# EAGLE design Output_Shield (EAGLE 5.06)
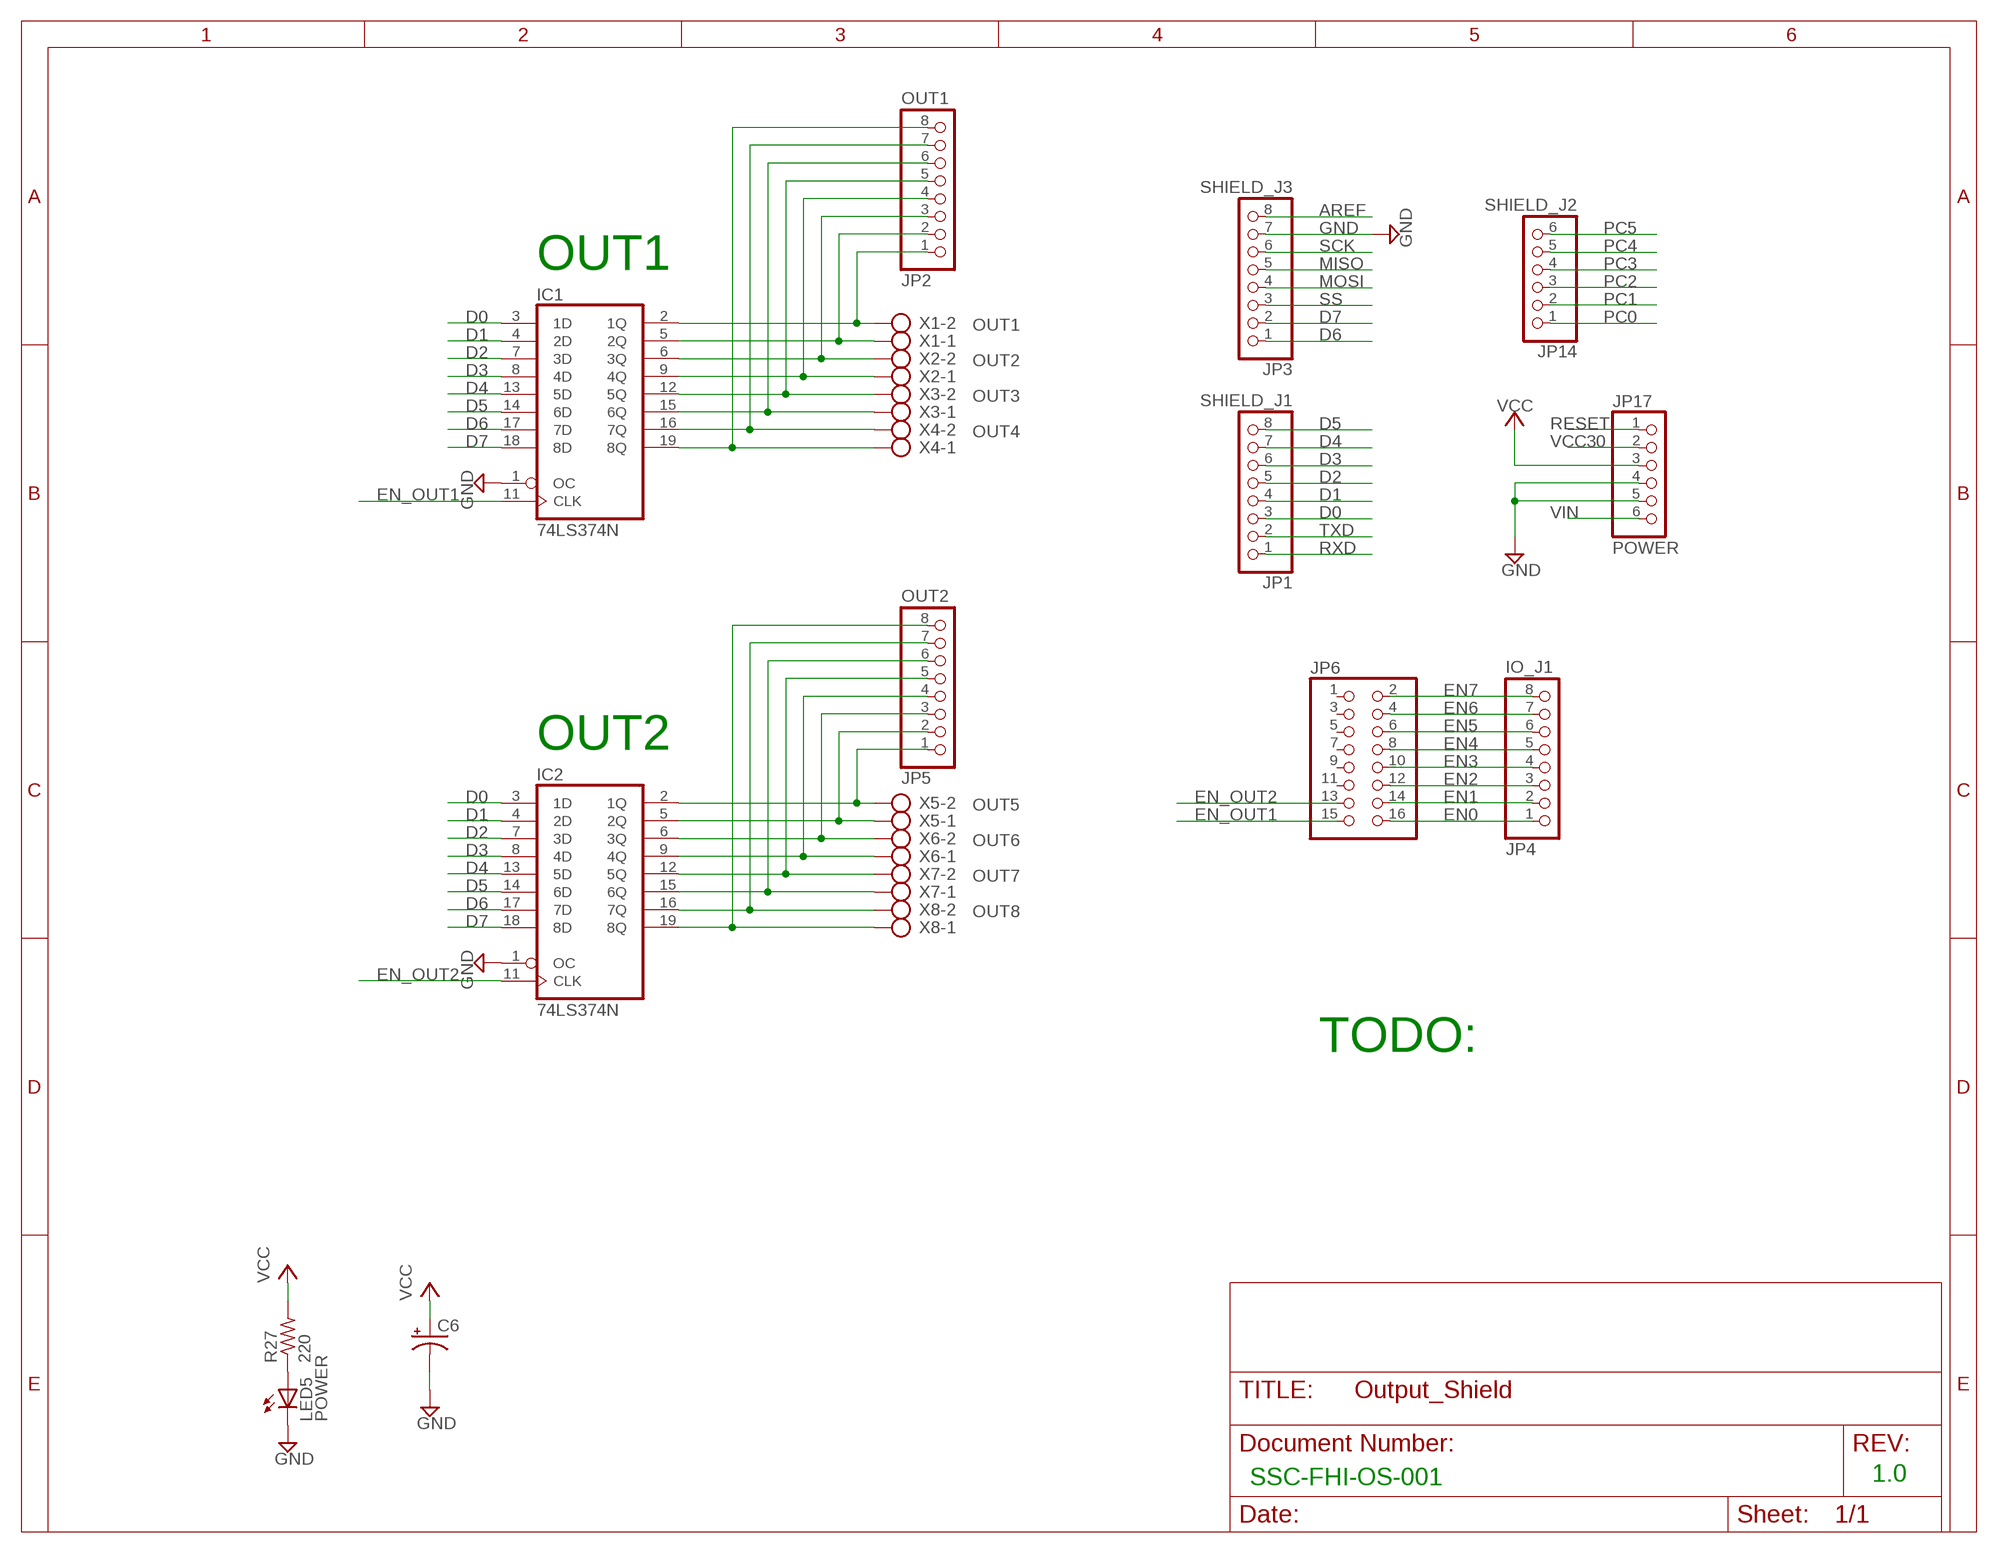
[diagram p0: schematic, sheet 1]

## Parts
C6  CPOL-USE2.5-5  [E2,5-5]
IC1  74LS374N  [DIL20]
IC2  74LS374N  [DIL20]
JP1  SHIELD_J1  PINHD-1X8  [1X08]
JP2  OUT1  PINHD-1X8  [1X08]
JP3  SHIELD_J3  PINHD-1X8  [1X08]
JP4  IO_J1  PINHD-1X8  [1X08]
JP5  OUT2  PINHD-1X8  [1X08]
JP6  PINHD-2X8  [2X08]
JP14  SHIELD_J2  PINHD-1X6  [1X06]
JP17  POWER  PINHD-1X6  [1X06]
LED5  POWER  LED5MM  [LED5MM]
R27  220  R-US_0204/7  [0204/7]
X1  OUT1  AK550/2  [AK550/2]
X2  OUT2  AK550/2  [AK550/2]
X3  OUT3  AK550/2  [AK550/2]
X4  OUT4  AK550/2  [AK550/2]
X5  OUT5  AK550/2  [AK550/2]
X6  OUT6  AK550/2  [AK550/2]
X7  OUT7  AK550/2  [AK550/2]
X8  OUT8  AK550/2  [AK550/2]

## Nets
AREF: JP3.8
D0: IC1.3(1D) IC2.3(1D) JP1.3
D1: IC1.4(2D) IC2.4(2D) JP1.4
D2: IC1.7(3D) IC2.7(3D) JP1.5
D3: IC1.8(4D) IC2.8(4D) JP1.6
D4: IC1.13(5D) IC2.13(5D) JP1.7
D5: IC1.14(6D) IC2.14(6D) JP1.8
D6: IC1.17(7D) IC2.17(7D) JP3.1
D7: IC1.18(8D) IC2.18(8D) JP3.2
EN0: JP4.1 JP6.16
EN1: JP4.2 JP6.14
EN2: JP4.3 JP6.12
EN3: JP4.4 JP6.10
EN4: JP4.5 JP6.8
EN5: JP4.6 JP6.6
EN6: JP4.7 JP6.4
EN7: JP4.8 JP6.2
EN_OUT1: IC1.11(CLK) JP6.15
EN_OUT2: IC2.11(CLK) JP6.13
GND: C6.- IC1.1(OC) IC2.1(OC) JP3.7 JP17.4 JP17.5 LED5.K(C)
MISO: JP3.5
MOSI: JP3.4
N$39: LED5.A R27.1
OUT1.1: IC1.2(1Q) JP2.1 X1.2
OUT1.2: IC1.5(2Q) JP2.2 X1.1
OUT1.3: IC1.6(3Q) JP2.3 X2.2
OUT1.4: IC1.9(4Q) JP2.4 X2.1
OUT1.5: IC1.12(5Q) JP2.5 X3.2
OUT1.6: IC1.15(6Q) JP2.6 X3.1
OUT1.7: IC1.16(7Q) JP2.7 X4.2
OUT1.8: IC1.19(8Q) JP2.8 X4.1
OUT2.1: IC2.2(1Q) JP5.1 X5.2
OUT2.2: IC2.5(2Q) JP5.2 X5.1
OUT2.3: IC2.6(3Q) JP5.3 X6.2
OUT2.4: IC2.9(4Q) JP5.4 X6.1
OUT2.5: IC2.12(5Q) JP5.5 X7.2
OUT2.6: IC2.15(6Q) JP5.6 X7.1
OUT2.7: IC2.16(7Q) JP5.7 X8.2
OUT2.8: IC2.19(8Q) JP5.8 X8.1
PC0: JP14.1
PC1: JP14.2
PC2: JP14.3
PC3: JP14.4
PC4: JP14.5
PC5: JP14.6
RESET: JP17.1
RXD: JP1.1
SCK: JP3.6
SS: JP3.3
TXD: JP1.2
VCC: C6.+ JP17.3 R27.2
VCC30: JP17.2
VIN: JP17.6
Unconnected: JP6.1 JP6.3 JP6.5 JP6.7 JP6.9 JP6.11

## Notes on the sheet
- OUT1
- OUT2
- TODO:
- SSC-FHI-OS-001 | 1.0

## Power pins joined to a net without a drawn wire
GND: IC1.10(GND) IC2.10(GND)
VCC: IC1.20(VCC) IC2.20(VCC)

## Library data of the parts
C6 = rcl:CPOL-US: POLARIZED CAPACITOR, American symbol
IC1 IC2 = 74xx-us:74*374: Octal D type transparent LATCH, edge triggered
JP1-JP5 = pinhead:PINHD-1X8: PIN HEADER
JP6 = pinhead:PINHD-2X8: PIN HEADER
JP14 JP17 = pinhead:PINHD-1X6: PIN HEADER
LED5 = led:LED: LED OSRAM: - CHIPLED LG R971, LG N971, LY N971, LG Q971, LY Q971, LO R971, LY R971 LH N974, LH R974 LS Q976, LO Q976, LY Q976 LO Q996 - Hyper CHIPLED LW Q18S LB Q993, LB Q99A, LB R99A - SideLED LS A670, LO A670, LY A670, LG A670, LP A670 LB A673, LV A673, LT A673, LW A673 LH A674 LY A675 LS A676, LA A676, LO A676, LY A676, LW A676 LS A679, LY A679, LG A679 - Hyper Micro SIDELED® LS Y876, LA Y876, LO Y876, LY Y876 LT Y87S - SmartLED LW L88C, LW L88S LB L89C, LB L89S, LG L890 LS L89K, LO L89K, LY L89K LS L896, LA L896, LO L896, LY L896 - TOPLED LS T670, LO T670, LY T670, LG T670, LP T670 LSG T670, LSP T670, LSY T670, LOP T670, LYG T670 LG T671, LOG T671, LSG T671 LB T673, LV T673, LT T673, LW T673 LH T674 LS T676, LA T676, LO T676, LY T676, LB T676, LH T676, LSB T676, LW T676 LB T67C, LV T67C, LT T67C, LS T67K, LO T67K, LY T67K, LW E67C LS E67B, LA E67B, LO E67B, LY E67B, LB E67C, LV E67C, LT E67C LW T67C LS T679, LY T679, LG T679 LS T770, LO T770, LY T770, LG T770, LP T770 LB T773, LV T773, LT T773, LW T773 LH T774 LS E675, LA E675, LY E675, LS T675 LS T776, LA T776, LO T776, LY T776, LB T776 LHGB T686 LT T68C, LB T68C - Hyper Mini TOPLED® LB M676 - Mini TOPLED Santana® LG M470 LS M47K, LO M47K, LY M47K Source: http://www.osram.convergy.de - LUMILED® LXK2-PW12-R00, LXK2-PW12-S00, LXK2-PW14-U00, LXK2-PW14-V00 LXK2-PM12-R00, LXK2-PM12-S00, LXK2-PM14-U00 LXK2-PE12-Q00, LXK2-PE12-R00, LXK2-PE12-S00, LXK2-PE14-T00, LXK2-PE14-U00 LXK2-PB12-K00, LXK2-PB12-L00, LXK2-PB12-M00, LXK2-PB14-N00, LXK2-PB14-P00, LXK2-PB14-Q00 LXK2-PR12-L00, LXK2-PR12-M00, LXK2-PR14-Q00, LXK2-PR14-R00 LXK2-PD12-Q00, LXK2-PD12-R00, LXK2-PD12-S00 LXK2-PH12-R00, LXK2-PH12-S00 LXK2-PL12-P00, LXK2-PL12-Q00, LXK2-PL12-R00 Source: www.luxeon.com
R27 = resistor:R-US_: RESISTOR, American symbol
X1-X8 = con-ptr500+_v5:AK550/2: CONNECTOR

## Board
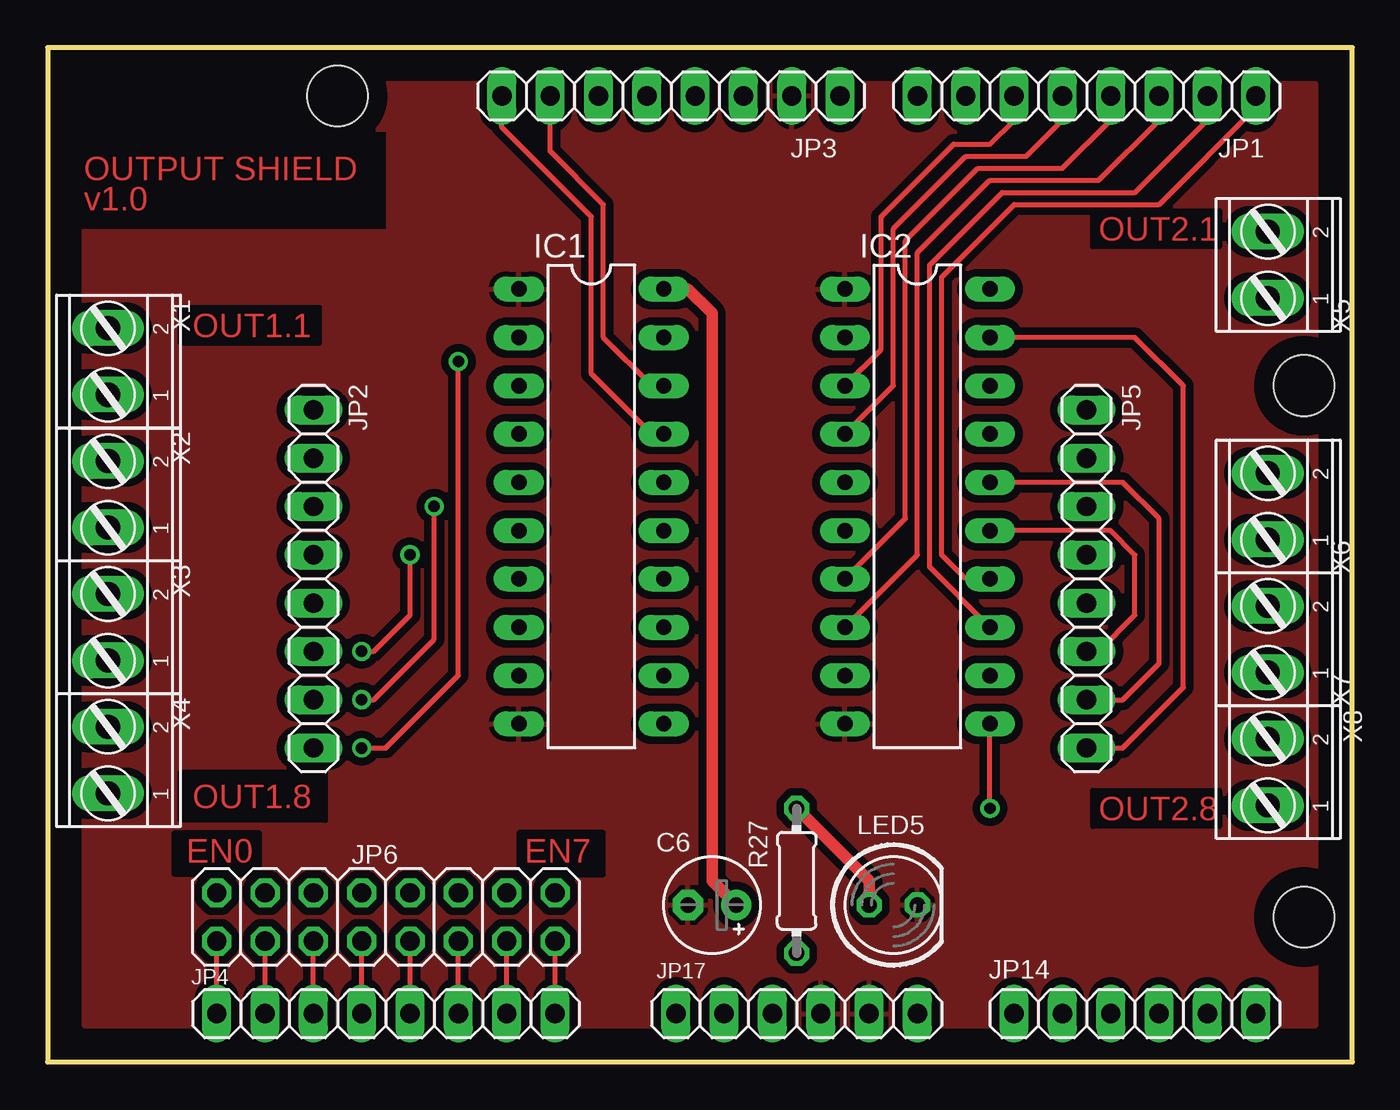
[diagram p1: board, top side]
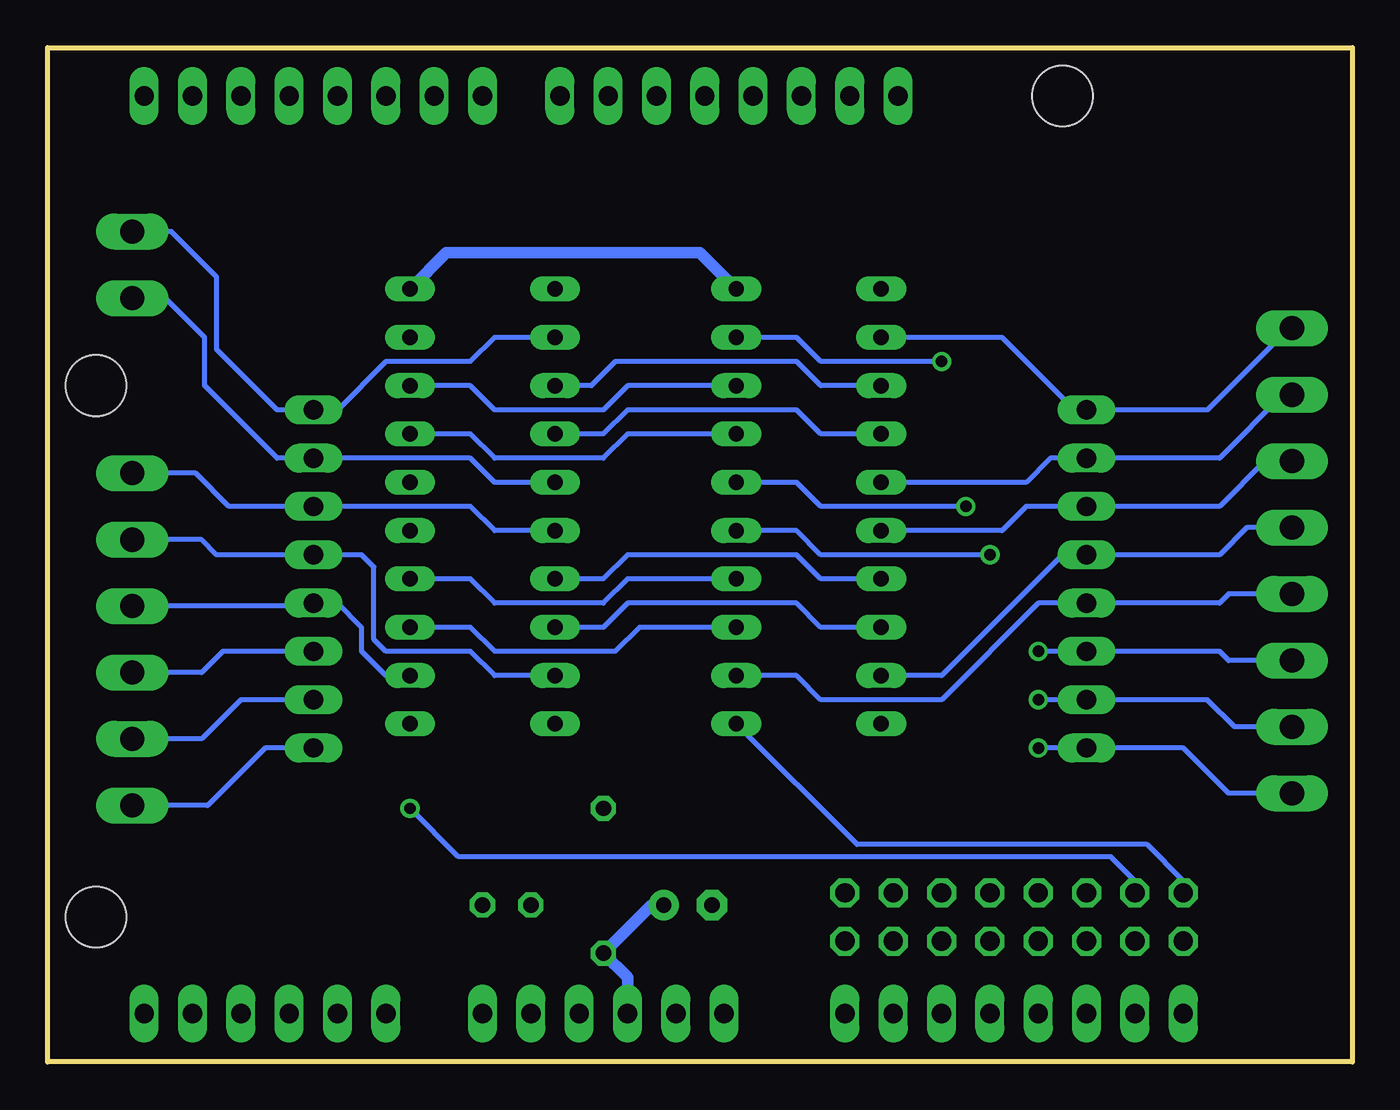
[diagram p2: board, bottom side, seen from below]

Size 68.58 x 53.34 mm. Coordinates in mm from the lower left corner, seen from the top.
Outline: 0,0 68.58,0 68.58,53.34 0,53.34 0,0
Copper layers (1*16): Top 0.035mm / dielectric 1.5mm / Bottom 0.035mm
Design rules "default *": minimum track width 8mil, minimum drill 20mil, track to track 16mil, track to pad 16mil, pad to pad 8mil, via to via 8mil, smd to smd 8mil, copper to edge 40mil, drill to drill 8mil, minimum pad ring 10mil, minimum via ring 8mil, stop-mask expansion 4mil, vias tented up to drill 0mil, thermal gap 10mil
Holes 3.2 mm at 66.04,35.56 66.04,7.62 15.24,50.8
tRestrict: area 0.6,43.8 to 17.8,48.9; area 6.7,9.8 to 11.1,12.1; area 24.8,9.8 to 29.2,12.1; area 7,12.7 to 14.6,15.2; area 7,37.8 to 14.3,39.7; area 54.9,42.9 to 61.6,44.8; area 54.9,12.4 to 61.6,14.3

### Footprints (pad centres in the part's own frame; a part is rotated, then mirrored left to right if it is on the bottom)
E2,5-5 = drill 0.813 pad 1.6 round: + -1.27,0 | drill 0.813 pad 1.6 octagon: - 1.27,0
DIL20 = drill 0.813 long: 1 -11.43,-3.81; 2 -8.89,-3.81; 3 -6.35,-3.81; 4 -3.81,-3.81; 5 -1.27,-3.81; 6 1.27,-3.81; 7 3.81,-3.81; 8 6.35,-3.81; 9 8.89,-3.81; 10 11.43,-3.81; 11 11.43,3.81; 12 8.89,3.81; 13 6.35,3.81; 14 3.81,3.81; 15 1.27,3.81; 16 -1.27,3.81; 17 -3.81,3.81; 18 -6.35,3.81; 19 -8.89,3.81; 20 -11.43,3.81
1X08 = drill 1.016 long: 1 -8.89,0; 2 -6.35,0; 3 -3.81,0; 4 -1.27,0; 5 1.27,0; 6 3.81,0; 7 6.35,0; 8 8.89,0
2X08 = drill 1.016 octagon: 1 -8.89,-1.27; 2 -8.89,1.27; 3 -6.35,-1.27; 4 -6.35,1.27; 5 -3.81,-1.27; 6 -3.81,1.27; 7 -1.27,-1.27; 8 -1.27,1.27; 9 1.27,-1.27; 10 1.27,1.27; 11 3.81,-1.27; 12 3.81,1.27; 13 6.35,-1.27; 14 6.35,1.27; 15 8.89,-1.27; 16 8.89,1.27
1X06 = drill 1.016 long: 1 -6.35,0; 2 -3.81,0; 3 -1.27,0; 4 1.27,0; 5 3.81,0; 6 6.35,0
LED5MM = drill 0.813 octagon: A -1.27,0; K 1.27,0
0204/7 = drill 0.813 octagon: 1 -3.81,0; 2 3.81,0
AK550/2 = drill 1.27 long: 1 -1.75,0; 2 1.75,0

### Placement (x,y rotation side)
C6  34.92,8.26 180 top
IC1  28.57,29.21 270 top
IC2  45.72,29.21 270 top
JP1  54.61,50.8 0 top
JP2  13.97,25.4 270 top
JP3  32.77,50.8 0 top
JP4  17.78,2.54 0 top
JP5  54.61,25.4 270 top
JP6  17.78,7.62 180 top
JP14  57.15,2.54 0 top
JP17  39.37,2.54 0 top
LED5  44.45,8.26 0 top
R27  39.37,9.53 270 top
X1  3.17,36.83 90 top
X2  3.17,29.84 90 top
X3  3.17,22.86 90 top
X4  3.17,15.88 90 top
X5  64.14,41.91 90 top
X6  64.14,29.21 90 top
X7  64.14,22.23 90 top
X8  64.14,15.24 90 top

### Tracks (layer width: path | path; a pad name or v marks a point on that pad's centre or on a via)
D0
  Top 0.254: IC2.3 43.81,37.47 43.81,44.45 47.62,48.26 49.53,48.26 50.8,49.53 JP1.3
  Bottom 0.254: IC2.3 40.01,35.56 38.73,36.83 29.21,36.83 27.94,35.56 IC1.3
D1
  Top 0.254: IC2.4 44.45,35.56 44.45,43.81 48.26,47.62 51.44,47.62 53.34,49.53 JP1.4
  Bottom 0.254: IC2.4 39.37,33.02 38.1,34.29 29.21,34.29 27.94,33.02 IC1.4
D2
  Top 0.254: IC2.7 45.09,28.57 45.09,43.18 48.9,46.99 53.34,46.99 55.88,49.53 JP1.5
  Bottom 0.254: IC2.7 39.37,25.4 38.1,26.67 29.21,26.67 27.94,25.4 IC1.7
D3
  Top 0.254: IC2.8 45.72,26.67 45.72,42.55 49.53,46.35 55.24,46.35 58.42,49.53 JP1.6
  Bottom 0.254: IC2.8 39.37,22.86 38.1,24.13 29.21,24.13 27.94,22.86 IC1.8
D4
  Top 0.254: JP1.7 60.96,49.53 57.15,45.72 50.16,45.72 46.35,41.91 46.35,26.04 IC2.13
  Bottom 0.254: IC2.13 46.35,22.86 45.09,21.59 38.73,21.59 37.47,22.86 IC1.13
D5
  Top 0.254: JP1.8 63.5,50.16 58.42,45.09 50.8,45.09 46.99,41.27 46.99,26.67 48.26,25.4 IC2.14
  Bottom 0.254: IC1.14 38.1,25.4 39.37,24.13 45.09,24.13 46.35,25.4 IC2.14
D6
  Top 0.254: JP3.1 23.88,49.15 28.57,44.45 28.57,36.2 31.75,33.02 IC1.17
  Bottom 0.254: IC2.17 46.35,33.02 45.09,31.75 39.37,31.75 38.1,33.02 IC1.17
D7
  Top 0.254: JP3.2 26.42,47.88 29.21,45.09 29.21,38.1 31.75,35.56 IC1.18
  Bottom 0.254: IC2.18 46.35,35.56 45.09,34.29 39.37,34.29 38.1,35.56 IC1.18
EN0
  Top 0.254: JP4.1 JP6.16
EN1
  Top 0.254: JP4.2 JP6.14
EN2
  Top 0.254: JP4.3 JP6.12
EN3
  Top 0.254: JP4.4 JP6.10
EN4
  Top 0.254: JP4.5 JP6.8
EN5
  Top 0.254: JP4.6 JP6.6
EN6
  Top 0.254: JP4.7 JP6.4
EN7
  Top 0.254: JP4.8 JP6.2
EN_OUT1
  Bottom 0.254: JP6.15 8.89,9.53 10.79,11.43 26.04,11.43 IC1.11
EN_OUT2  (via drill 0.6)
  Top 0.254: v49.53,13.34 IC2.11
  Bottom 0.254: JP6.13 11.43,9.53 12.7,10.79 46.99,10.79 v49.53,13.34
GND
  pour Top: 1.91,1.91 66.67,1.91 66.67,51.44 1.91,51.44
N$39
  Top 0.61: R27.1 43.18,9.53 LED5.A
OUT1.1
  Bottom 0.254: X1.2 3.33,38.58 7.62,34.29 JP2.1 14.61,34.29 18.41,38.1 IC1.2
OUT1.2
  Bottom 0.254: IC1.5 17.14,30.48 15.88,31.75 JP2.2 6.99,31.75 3.65,35.08 X1.1
OUT1.3
  Bottom 0.254: IC1.6 18.41,27.94 17.14,29.21 JP2.3 6.99,29.21 4.6,31.59 X2.2
OUT1.4
  Bottom 0.254: IC1.9 21.59,20.32 15.24,26.67 JP2.4 6.99,26.67 5.56,28.09 X2.1
OUT1.5
  Bottom 0.254: IC1.12 29.21,20.32 27.94,19.05 21.59,19.05 16.51,24.13 JP2.5 6.99,24.13 6.5,24.61 X3.2
OUT1.6  (via drill 0.6)
  Top 0.254: v16.51,21.59 17.14,21.59 19.05,23.5 v19.05,26.67
  Bottom 0.254: IC1.15 29.21,27.94 27.94,26.67 v19.05,26.67 | X3.1 6.5,21.11 6.99,21.59 JP2.6 v16.51,21.59
OUT1.7  (via drill 0.6)
  Top 0.254: v16.51,19.05 17.14,19.05 20.32,22.23 v20.32,29.21
  Bottom 0.254: IC1.16 29.21,30.48 27.94,29.21 v20.32,29.21 | X4.2 6.2,17.62 7.62,19.05 JP2.7 v16.51,19.05
OUT1.8  (via drill 0.6)
  Top 0.254: v16.51,16.51 17.78,16.51 21.59,20.32 v21.59,36.83
  Bottom 0.254: IC1.19 29.21,38.1 27.94,36.83 v21.59,36.83 | X4.1 6.5,14.12 8.89,16.51 JP2.8 v16.51,16.51
OUT2.1
  Bottom 0.254: X5.2 62.08,43.66 59.69,41.27 59.69,37.47 56.52,34.29 JP5.1 53.34,34.29 50.8,36.83 46.35,36.83 45.09,38.1 IC2.2
OUT2.2
  Bottom 0.254: X5.1 62.38,40.16 60.33,38.1 60.33,35.56 56.52,31.75 JP5.2 46.35,31.75 45.09,30.48 IC2.5
OUT2.3
  Bottom 0.254: X6.2 60.8,30.96 59.05,29.21 JP5.3 46.35,29.21 45.09,27.94 IC2.6
OUT2.4
  Bottom 0.254: X6.1 60.48,27.46 59.69,26.67 JP5.4 52.07,26.67 51.44,26.04 51.44,22.23 50.8,21.59 46.35,21.59 45.09,20.32 IC2.9
OUT2.5
  Bottom 0.254: X7.2 54.77,23.98 JP5.5 53.34,24.13 52.07,22.86 52.07,21.59 50.8,20.32 IC2.12
OUT2.6
  Top 0.254: IC2.15 55.88,27.94 57.15,26.67 57.15,23.5 55.24,21.59 JP5.6
  Bottom 0.254: X7.1 60.49,20.48 59.37,21.59 JP5.6
OUT2.7
  Top 0.254: IC2.16 56.52,30.48 58.42,28.57 58.42,20.95 56.52,19.05 JP5.7
  Bottom 0.254: X8.2 60.48,16.99 58.42,19.05 JP5.7
OUT2.8
  Top 0.254: IC2.19 57.15,38.1 59.69,35.56 59.69,19.68 56.52,16.51 JP5.8
  Bottom 0.254: X8.1 60.17,13.49 57.15,16.51 JP5.8
VCC
  Top 0.61: IC1.20 33.66,40.64 34.92,39.37 34.92,9.53 C6.+
  Bottom 0.61: IC2.20 47.62,42.55 34.29,42.55 IC1.20 | C6.+ 36.83,8.26 R27.2 38.1,4.45 JP17.3

### Text on the board
Top: OUTPUT SHIELD | v1.0 | OUT2.1 | OUT1.1 | OUT1.8 | OUT2.8 | EN0 | EN7